# Altium schematic sheet Phase Current Voltage Sense.SchDoc
size A4
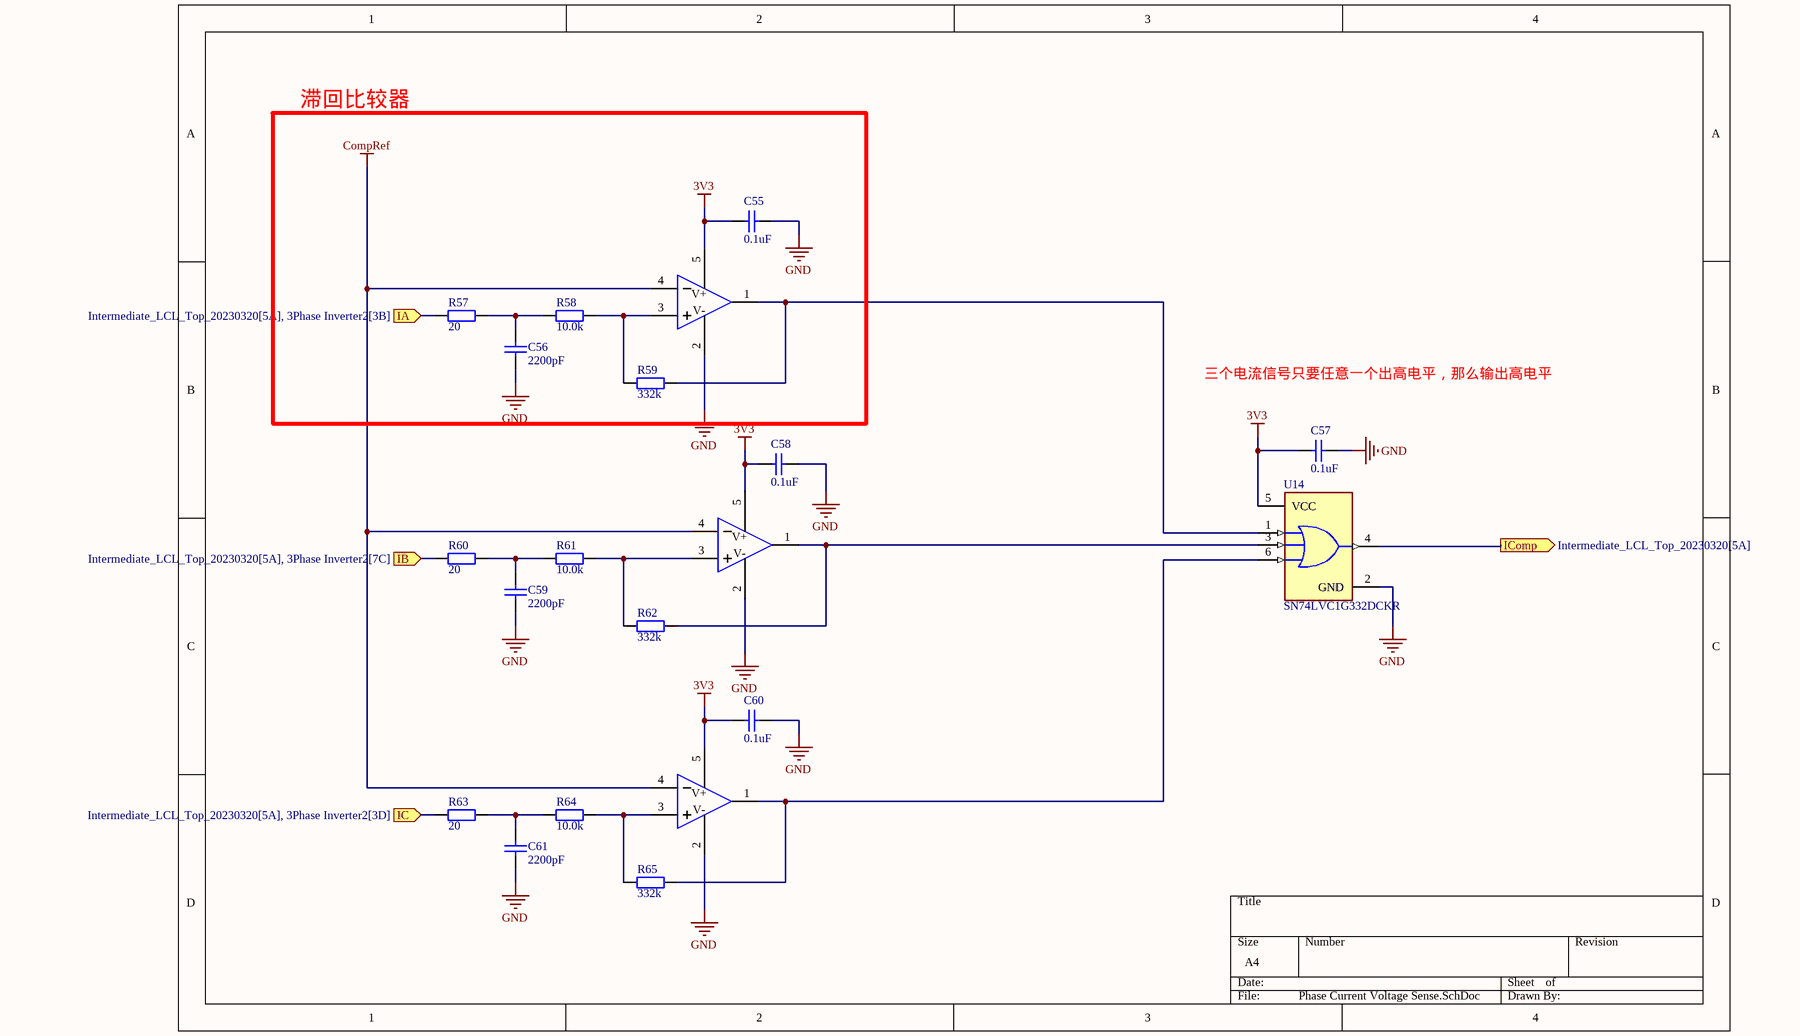
[diagram p0: Phase Current Voltage Sense.SchDoc]

## Parts
C55  0.1uF  [CAPC1608X06N]
C56  2200pF  [CAPC1608X06N]
C57  0.1uF  [CAPC1608X06N]
C58  0.1uF  [CAPC1608X06N]
C59  2200pF  [CAPC1608X06N]
C60  0.1uF  [CAPC1608X06N]
C61  2200pF  [CAPC1608X06N]
R57  20  [RESC1608X05N]
R58  10.0k  [RESC1608X05N]
R59  332k  [RESC1608X05N]
R60  20  [RESC1608X05N]
R61  10.0k  [RESC1608X05N]
R62  332k  [RESC1608X05N]
R63  20  [RESC1608X05N]
R64  10.0k  [RESC1608X05N]
R65  332k  [RESC1608X05N]
U13  TLV3201AIDBVR  [SOT-23-5_L3.0-W1.7-P0.95-LS2.8-BR]  (value not drawn)
U14  SN74LVC1G332DCKR  [FP-DCK0006A-MFG]
U15  TLV3201AIDBVR  [SOT-23-5_L3.0-W1.7-P0.95-LS2.8-BR]  (value not drawn)
U16  TLV3201AIDBVR  [SOT-23-5_L3.0-W1.7-P0.95-LS2.8-BR]  (value not drawn)

## Ports
IA (in, see Intermediate_LCL_Top_20230320[5A], 3Phase Inverter2[3B]), IB (in, see Intermediate_LCL_Top_20230320[5A], 3Phase Inverter2[7C]), IC (in, see Intermediate_LCL_Top_20230320[5A], 3Phase Inverter2[3D]), IComp (out, see Intermediate_LCL_Top_20230320[5A])

## Nets
3V3: C55.1 C57.1 C58.1 C60.1 U13.5(VCC) U14.5(VCC) U15.5(VCC) U16.5(VCC)
CompRef: U13.4(IN-) U15.4(IN-) U16.4(IN-)
GND: C55.2 C56.2 C57.2 C58.2 C59.2 C60.2 C61.2 U13.2(GND) U14.2(GND) U15.2(GND) U16.2(GND)
IA: R57.2 ; port IA
IB: R60.2 ; port IB
IC: R63.2 ; port IC
IComp: U14.4(Y) ; port IComp
NetC56_1: C56.1 R57.1 R58.2
NetC59_1: C59.1 R60.1 R61.2
NetC61_1: C61.1 R63.1 R64.2
NetR58_1: R58.1 R59.2 U13.3(IN+)
NetR59_1: R59.1 U13.1(OUT) U14.1(A)
NetR61_1: R61.1 R62.2 U15.3(IN+)
NetR62_1: R62.1 U14.3(B) U15.1(OUT)
NetR64_1: R64.1 R65.2 U16.3(IN+)
NetR65_1: R65.1 U14.6(C) U16.1(OUT)

## Notes on the sheet
- 滞回比较器
- 三个电流信号只要任意一个出高电平，那么输出高电平
- (in symbol TLV3201AIDBVR) V+; V-

## Library data of the parts
C55-C61 = Cap: Capacitor; Published: 8-Jun-2000; LatestRevisionDate: 17-Jul-2002; LatestRevisionNote: Re-released for DXP Platform.; PackageReference: RAD-0.3; Publisher: Altium Limited; PackageDescription: Radial Cap, Thru-Hole; 2 Leads; 0.3 in Pin Spacing
  C55 C57 C58 C60: Value: 0.1uF
  C56 C59 C61: Value: 2200pF
R57-R65 = 0603 100KΩ (1003) 1%_4: 贴片电阻; Value: 1MΩ(1%); ComponentLink1Description: 供应商链接; ComponentLink1URL: http://www.szlcsc.com/product/details_26546.html; Package: 0603; Supplier: LC; SuppliersPartNumber: C25803
U13 U15 U16 = TLV3201AIDBVR: Manufacturer: TI(德州仪器); Add into BOM: yes; Input Offset Voltage (Vos): 1mV; Input Bias Current (Ib): 5nA; Propagation Delay Time: 40ns; Input Hysteresis Voltage (Vhys): 1.2mV; Common Mode Rejection Ratio (CMRR): 70dB; Supply Voltage: 2.7V~5.5V; Output Type: 推挽; Supply Current: 40uA; Symbol: TLV3201AIDBVR; Device: TLV3201AIDBVR; LCSC Part Name: TLV3201AIDBVR; Supplier Part: C105188; Manufacturer Part: TLV3201AIDBVR; Supplier Footprint: SOT-23-5; JLCPCB Part Class: Extended Part; Datasheet: https://www.ti.com/cn/lit/gpn/tlv3201; Supplier: LCSC; Convert to PCB: yes; Output Mode: -; Rail-to-Rail: -; Operating Temperature: -40℃~+125℃
U14 = CMP-0859-00464-4: IC GATE OR 1CH 3-INP SC70-6; Manufacturer: Texas Instruments; Min Supply Voltage: 1.65V; Number Of Circuits: 1; Nominal Supply Current: 10uA; Number Of Inputs: 3; Max Supply Voltage: 5.5V; Propagation Delay: 20ns; Standoff Height: 0mm; Logic Function Desc: Non-Inverting; Manufacturer Part Number: SN74LVC1G332DCKR; Automotive: No; Temperature: -40°C to +125°C; Device Class L1: Integrated Circuits (ICs); ComponentLink2URL: http://www.ti.com/lit/ds/symlink/sn74lvc1g332.pdf; RoHS: TRUE; Digikey Description: IC GATE OR 1CH 3-INP SC70-6; Octopart: https://octopart.com/sn74lvc1g332dckr-texas+instruments-464861; Ambient Temperature Range Low: -40°C; Number Of Outputs: 1; Height: 1.1mm; Device Class L2: Logic ICs; Mouser Description: Logic Gates Single 3-Input Pos- OR Gate; ComponentLink2Description: Datasheet; Package: DCK0006A; Temperature Range Low: -40°C; Ambient Temperature Range High: +125°C; Temperature Range High: +125°C; Category: IC; Device Class L3: Logic Gates; Lead Free: Yes